# Altium schematic sheet stabs.SchDoc
size A4
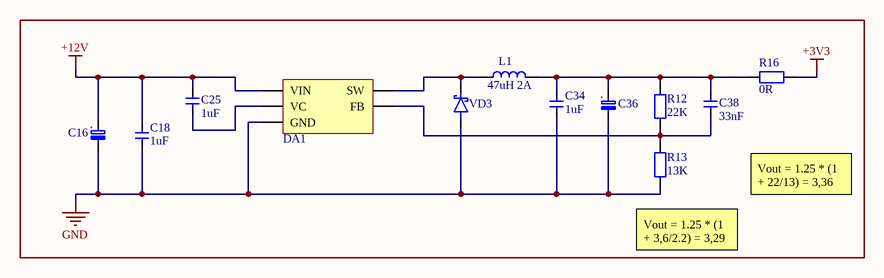
[diagram p0: stabs.SchDoc]

## Parts
C16  25V 220uF  [D8C3.2H12]  (value not drawn)
C18  1uF  [CAP0805]
C25  1uF  [CAP0805]
C34  1uF  [CAP0805]
C36  10V 330uF  [D10C4.4H10]  (value not drawn)
C38  33nF  [CAP0805]
DA1  XL4015  [TO263-5L]  (value not drawn)
L1  47uH 2A  [IND: B82477G]
R12  22K  [RES0805]
R13  13K  [RES0805]
R16  0R  [RES1206]
VD3  (no value)  [DO-214AC (SMA)]

## Nets
+3V3: R16.2
+12V: C16.1(PLUS) C18.2 C25.2 DA1.5(VIN)
GND: C16.2(MINUS) C18.1 C34.1 C36.2(MINUS) DA1.1(GND) R13.1 VD3.A
NetC25_1: C25.1 DA1.4(VC)
NetC34_2: C34.2 C36.1(PLUS) C38.2 L1.2 R12.2 R16.1
NetC38_1: C38.1 DA1.2(FB) R12.1 R13.2
NetDA1_3: DA1.3(SW) L1.1 VD3.K

## Notes on the sheet
- Vout = 1.25 * (1 + 22/13) = 3,36
- (near R13) Vout = 1.25 * (1 + 3,6/2.2) = 3,29
- (in symbol Cap Aluminum) +

## Library data of the parts
C16 C36 = Cap Aluminum: Electrolytic Cap; ComponentLink1Description: Chipdip
  C16: ComponentLink1URL: https://www.chipdip.ru/product0/9000565743
  C36: ComponentLink1URL: https://www.chipdip.ru/product0/9000565748
C18 C25 C34 C38 = CAP Ceramic: Ceramic SMD Cap
DA1 = XL4015: Buck converter
L1 = Inductor: Inductance; ComponentLink1Description: Chipdip; ComponentLink1URL: https://www.chipdip.ru/product/b82477g4473m
R12 R13 R16 = RES: RES smd
VD3 = Diode Schottky